# EAGLE design Y-babies -- PicAxe v.1.4 (EAGLE 6.5.0)
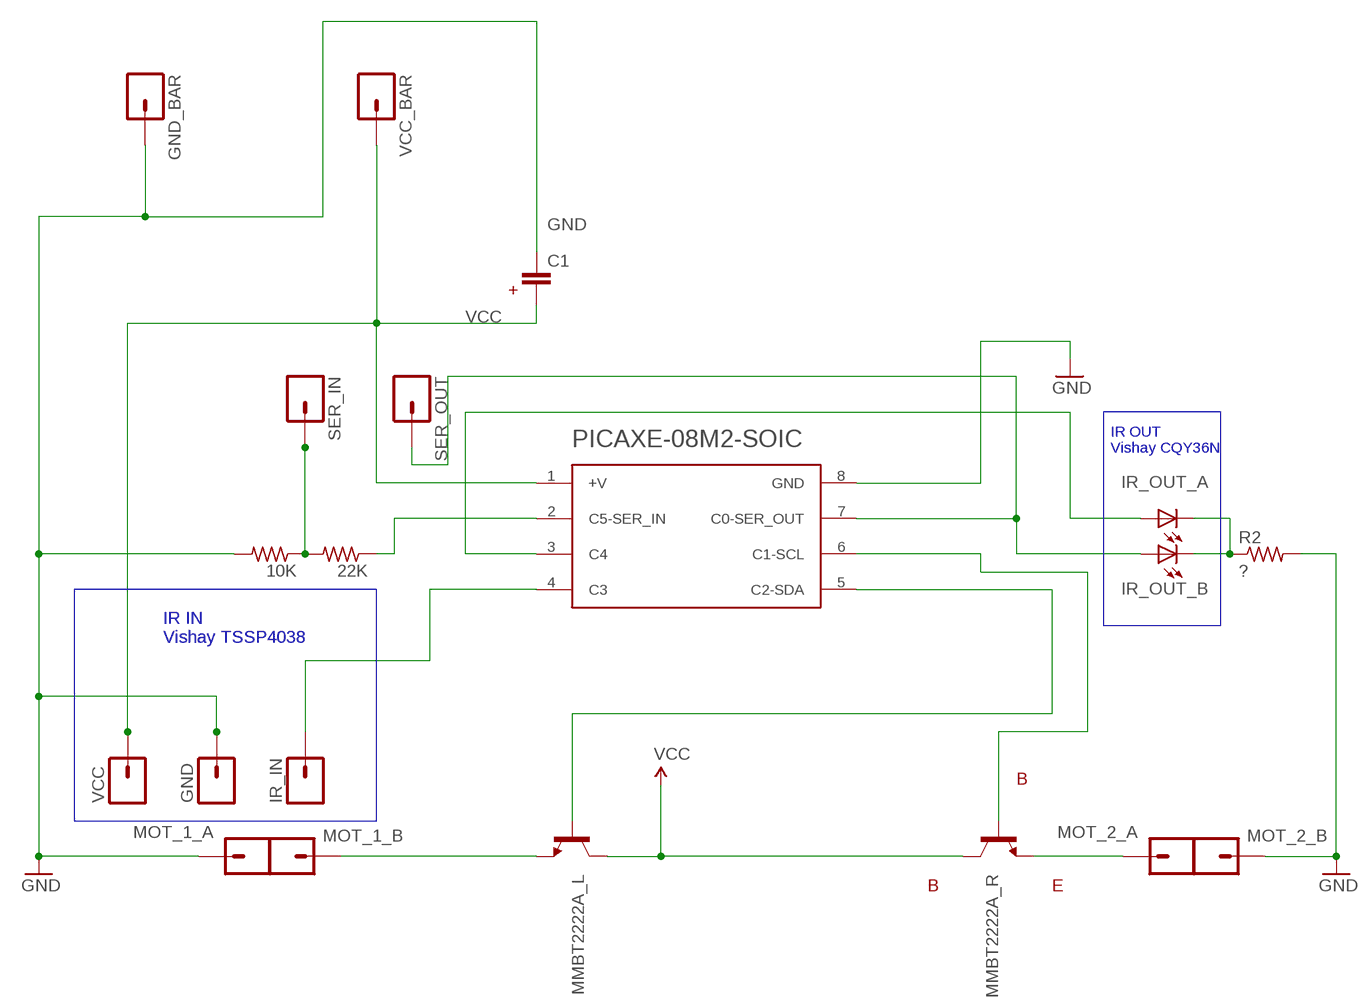
[diagram p0: schematic, sheet 1]

## Parts
10K  R-US_R0402  [R0402]
22K  R-US_R0402  [R0402]
C1  CAPPTH1  [CAP-PTH-5MM]
GND  M01PTH  [1X01]
GND_BAR  M01PTH  [1X01]
IR_IN  M01PTH  [1X01]
IR_OUT_A  LED3MM  [LED3MM]
IR_OUT_B  LED3MM  [LED3MM]
MMBT2222A_L  TRANSISTOR_NPNSOT23  [SOT23]
MMBT2222A_R  TRANSISTOR_NPNSOT23  [SOT23]
MOT_1_A  M01SMD-4.5X1.5  [PAD-1.5X4.5]
MOT_1_B  M01SMD-4.5X1.5  [PAD-1.5X4.5]
MOT_2_A  M01SMD-4.5X1.5  [PAD-1.5X4.5]
MOT_2_B  M01SMD-4.5X1.5  [PAD-1.5X4.5]
R2  ?  R-US_R0402  [R0402]
SER_IN  M01SMD-4.5X1.5  [PAD-1.5X4.5]
SER_OUT  M01SMD-4.5X1.5  [PAD-1.5X4.5]
U$1  PICAXE-08M2_SOIC  [SOIC8]
VCC  M01PTH  [1X01]
VCC_BAR  M01PTH  [1X01]

## Nets
E: MMBT2222A_R.2(E) MOT_2_A.P$1
GND: 10K.2 C1.1 GND.1 GND_BAR.1 MOT_1_A.P$1 MOT_2_B.P$1 R2.2 U$1.8(GND)
N$1: MMBT2222A_L.1(B) U$1.5(C2-SDA)
N$2: MMBT2222A_R.1(B) U$1.6(C1-SCL)
N$3: IR_OUT_B.A SER_OUT.P$1 U$1.7(C0-SER_OUT)
N$5: 10K.1 22K.2 SER_IN.P$1
N$6: IR_OUT_A.A U$1.3(C4)
N$7: IR_OUT_A.K(C) IR_OUT_B.K(C) R2.1
N$8: 22K.1 U$1.2(C5-SER_IN)
N$9: MMBT2222A_L.2(E) MOT_1_B.P$1
N$11: IR_IN.1 U$1.4(C3)
VCC: C1.2 MMBT2222A_L.3(C) MMBT2222A_R.3(C) U$1.1(+V) VCC.1 VCC_BAR.1

## Buses
B$1
B$2

## Notes on the sheet
- +
- IR OUT
  Vishay CQY36N
- IR IN
  Vishay TSSP4038
- B
- B | E

## Library data of the parts
10K 22K R2 = resistor:R-US_: RESISTOR, American symbol
C1 = SparkFun:CAP: Capacitor Standard 0603 ceramic capacitor, and 0.1" leaded capacitor.
GND GND_BAR IR_IN MOT_1_A MOT_1_B MOT_2_A MOT_2_B SER_IN SER_OUT VCC VCC_BAR = SparkFun:M01: Header 1 Standard 1-pin 0.1" header. Use with straight break away headers (SKU : PRT-00116), right angle break away headers (PRT-00553), swiss pins (PRT-00743), machine pins (PRT-00117), and female headers (PRT-00115).
IR_OUT_A IR_OUT_B = led:LED: LED OSRAM: - CHIPLED LG R971, LG N971, LY N971, LG Q971, LY Q971, LO R971, LY R971 LH N974, LH R974 LS Q976, LO Q976, LY Q976 LO Q996 - Hyper CHIPLED LW Q18S LB Q993, LB Q99A, LB R99A - SideLED LS A670, LO A670, LY A670, LG A670, LP A670 LB A673, LV A673, LT A673, LW A673 LH A674 LY A675 LS A676, LA A676, LO A676, LY A676, LW A676 LS A679, LY A679, LG A679 - Hyper Micro SIDELED® LS Y876, LA Y876, LO Y876, LY Y876 LT Y87S - SmartLED LW L88C, LW L88S LB L89C, LB L89S, LG L890 LS L89K, LO L89K, LY L89K LS L896, LA L896, LO L896, LY L896 - TOPLED LS T670, LO T670, LY T670, LG T670, LP T670 LSG T670, LSP T670, LSY T670, LOP T670, LYG T670 LG T671, LOG T671, LSG T671 LB T673, LV T673, LT T673, LW T673 LH T674 LS T676, LA T676, LO T676, LY T676, LB T676, LH T676, LSB T676, LW T676 LB T67C, LV T67C, LT T67C, LS T67K, LO T67K, LY T67K, LW E67C LS E67B, LA E67B, LO E67B, LY E67B, LB E67C, LV E67C, LT E67C LW T67C LS T679, LY T679, LG T679 LS T770, LO T770, LY T770, LG T770, LP T770 LB T773, LV T773, LT T773, LW T773 LH T774 LS E675, LA E675, LY E675, LS T675 LS T776, LA T776, LO T776, LY T776, LB T776 LHGB T686 LT T68C, LB T68C - Hyper Mini TOPLED® LB M676 - Mini TOPLED Santana® LG M470 LS M47K, LO M47K, LY M47K Source: http://www.osram.convergy.de LUXEON: - LUMILED® LXK2-PW12-R00, LXK2-PW12-S00, LXK2-PW14-U00, LXK2-PW14-V00 LXK2-PM12-R00, LXK2-PM12-S00, LXK2-PM14-U00 LXK2-PE12-Q00, LXK2-PE12-R00, LXK2-PE12-S00, LXK2-PE14-T00, LXK2-PE14-U00 LXK2-PB12-K00, LXK2-PB12-L00, LXK2-PB12-M00, LXK2-PB14-N00, LXK2-PB14-P00, LXK2-PB14-Q00 LXK2-PR12-L00, LXK2-PR12-M00, LXK2-PR14-Q00, LXK2-PR14-R00 LXK2-PD12-Q00, LXK2-PD12-R00, LXK2-PD12-S00 LXK2-PH12-R00, LXK2-PH12-S00 LXK2-PL12-P00, LXK2-PL12-Q00, LXK2-PL12-R00 Source: www.luxeon.com KINGBRIGHT: KA-3528ASYC Source: www.kingbright.com
MMBT2222A_L MMBT2222A_R = SparkFun:TRANSISTOR_NPN: Transistor NPN BJT configuration in SOT23 package. MMBT2222 is the common NPN we use. Double check BCE configuration again layout.
U$1 = atmel:PICAXE-08M2_SOIC

## Board
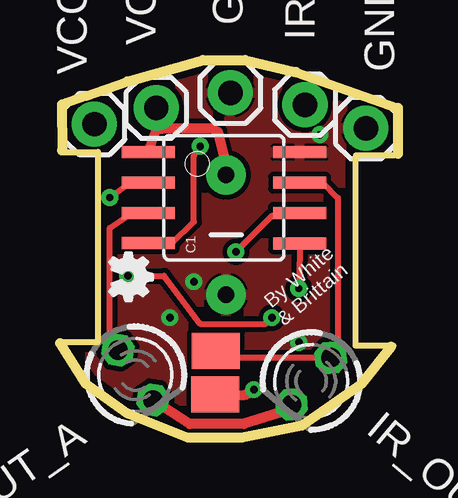
[diagram p1: board, top side]
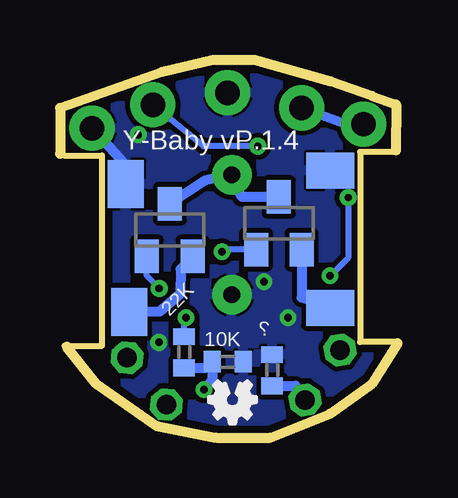
[diagram p2: board, bottom side, seen from below]

Size 14.08 x 15.75 mm. Coordinates in mm from the lower left corner, seen from the top.
Outline: 1.58,11.92 1.58,4
Outline: 0.01,11.91 1.59,11.91
Outline: 0,3.98 1.58,3.98
Outline: 0.01,3.94 1.08,2.25 2.83,1 5.33,0 7.58,0 10.08,0.5 12.58,2.25 13.79,3.78
Outline: 0.08,11.97 0.08,13.89 1.08,14.25 2.79,14.85 5.96,15.75 7.71,15.75 9.83,15.25 14.08,13.75 14.08,11.83
Outline: 12.33,3.83 12.33,11.75
Outline: 13.9,3.83 12.32,3.83
Outline: 13.91,11.77 12.33,11.77
Copper layers (1*16): Top 0.035mm / dielectric 1.5mm / Bottom 0.035mm
Design rules "default *": minimum track width 10mil, minimum drill 24mil, track to track 8mil, track to pad 8mil, pad to pad 8mil, via to via 8mil, smd to smd 8mil, copper to edge 12mil, drill to drill 3mil, minimum pad ring 10mil, minimum via ring 8mil, stop-mask expansion 4mil, vias tented up to drill 11.81101875mm, thermal gap 4mil

### Footprints (pad centres in the part's own frame; a part is rotated, then mirrored left to right if it is on the bottom)
R0402 = smd 0.7 x 0.9: 1 -0.65,0; 2 0.65,0
CAP-PTH-5MM = drill 0.7 pad 1.651: 1 -2.5,0; 2 2.5,0
1X01 = drill 1.016 pad 1.88: 1 0,0
LED3MM = drill 0.813 octagon: A -1.27,0; K 1.27,0
SOT23 = smd 1 x 1.4: 1 -0.95,-1.1; 2 0.95,-1.1; 3 0,1.1
PAD-1.5X4.5 = smd 1.5 x 2: P$1 0,0
SOIC8 = smd 0.5 x 2.2: 1 -1.905,-3.154; 2 -0.645,-3.154; 3 0.625,-3.154; 4 1.895,-3.154; 5 1.905,3.154; 6 0.635,3.154; 7 -0.635,3.154; 8 -1.905,3.154

### Placement (x,y rotation side)
10K  7.09,3.16 0 bottom
22K  8.91,3.56 270 bottom
C1  6.92,8.46 90 top
GND  7.1,14.38 0 top
GND_BAR  12.75,12.9 0 top
IR_IN  10.21,13.88 0 top
IR_OUT_A  3.14,2.61 305 top
IR_OUT_B  10.47,2.35 230 top
MMBT2222A_L  9.51,8.66 0 bottom
MMBT2222A_R  4.96,8.94 0 bottom
MOT_1_A  11.33,10.57 0 bottom
MOT_1_B  11.19,5.25 0 bottom
MOT_2_A  2.83,5.41 90 bottom
MOT_2_B  2.81,11.14 90 bottom
R2  5.24,2.81 90 bottom
SER_IN  6.46,1.8 270 top
SER_OUT  6.49,3.61 270 top
U$1  6.83,10 270 top
U$3  [OSHW_FILLX70_NOTEXT]  2.07,7.7 270 top
U$4  [OSHW_FILLX70_NOTEXT]  5.9,2.36 180 bottom
VCC  4.01,13.75 0 top
VCC_BAR  1.43,13.07 0 top

### Tracks (layer width: path | path; a pad name or v marks a point on that pad's centre or on a via)
E
  Bottom 0.406: MMBT2222A_R.2 4.01,5.84 MOT_2_A.P$1
GND  (via drill 0.3)
  Bottom 0.406: MOT_1_A.P$1 11.26,11.25 GND_BAR.1
  other vias: 4.58,5 9.96,3.98 10.82,12.63 5.58,6.5
  pour Bottom: 1.08,15.75 1.08,0 12.58,-0.25 12.58,15.75
  pour Top: 1.08,15.75 1.08,0 12.58,-0.25 12.58,15.75
N$1  (via drill 0.3)
  Top 0.254: U$1.5 9.96,6.57 v9.95,6.22
  Bottom 0.254: MMBT2222A_L.1 10.48,6.78 v9.95,6.22
N$2  (via drill 0.3)
  Top 0.254: v7.33,7.75 8.83,9.25 9.87,9.25 U$1.6
  Bottom 0.254: MMBT2222A_R.1 6.99,7.84 v7.33,7.75
N$3
  Top 0.254: U$1.7 10.95,10.63 11.58,10 11.58,3.62 IR_OUT_B.A 6.85,3.33 SER_OUT.P$1
N$5  (via drill 0.3)
  Top 0.406: SER_IN.P$1 7.67,1.77 v8.08,2
  Bottom 0.406: 22K.2 7.99,2.91 10K.1 7.74,2.41 v8.08,2
N$6
  Top 0.254: IR_OUT_A.A 2.07,4.17 2.08,8.75 2.8,9.25 U$1.3
N$7
  Top 0.406: IR_OUT_B.K 9.46,1.13 7.67,0.57 5.4,0.57 IR_OUT_A.K
  Bottom 0.406: R2.1 4.28,2.16 IR_OUT_A.K
N$8  (via drill 0.3)
  Top 0.254: U$1.2 2.98,10.64 v2.08,10.01 | v2.83,6.75 4.33,6.75 5.83,4.75 8.58,4.75 v8.83,5
  Bottom 0.254: 22K.1 8.91,4.92 v8.83,5 | v2.08,10.01 2.08,7.5 v2.83,6.75
N$9
  Bottom 0.406: MMBT2222A_L.2 9.06,7.02 9.08,6 9.94,5.25 MOT_1_B.P$1
N$11  (via drill 0.3)
  Top 0.254: U$1.4 4.69,8.11 5.58,9 5.58,11.75 v5.84,12.15
  Bottom 0.254: v5.84,12.15 8.09,12.15 IR_IN.1
VCC
  Top 0.406: C1.2 6.88,11.5 6.58,12.75 6.35,12.9 4.6,12.9 4.04,12.86 | U$1.1 4.04,12.86 | 4.04,12.86 4.04,13.31 VCC.1
  Bottom 0.406: VCC_BAR.1 2.19,13.07 VCC.1 | MMBT2222A_L.3 8.05,10.71 C1.2 6.5,10.04 MMBT2222A_R.3

### Text on the board
_tsilk: By White / & Brittain
_bsilk: Y-Baby vP.1.4 | ?